# Altium schematic sheet Periferico.SchDoc
size A4
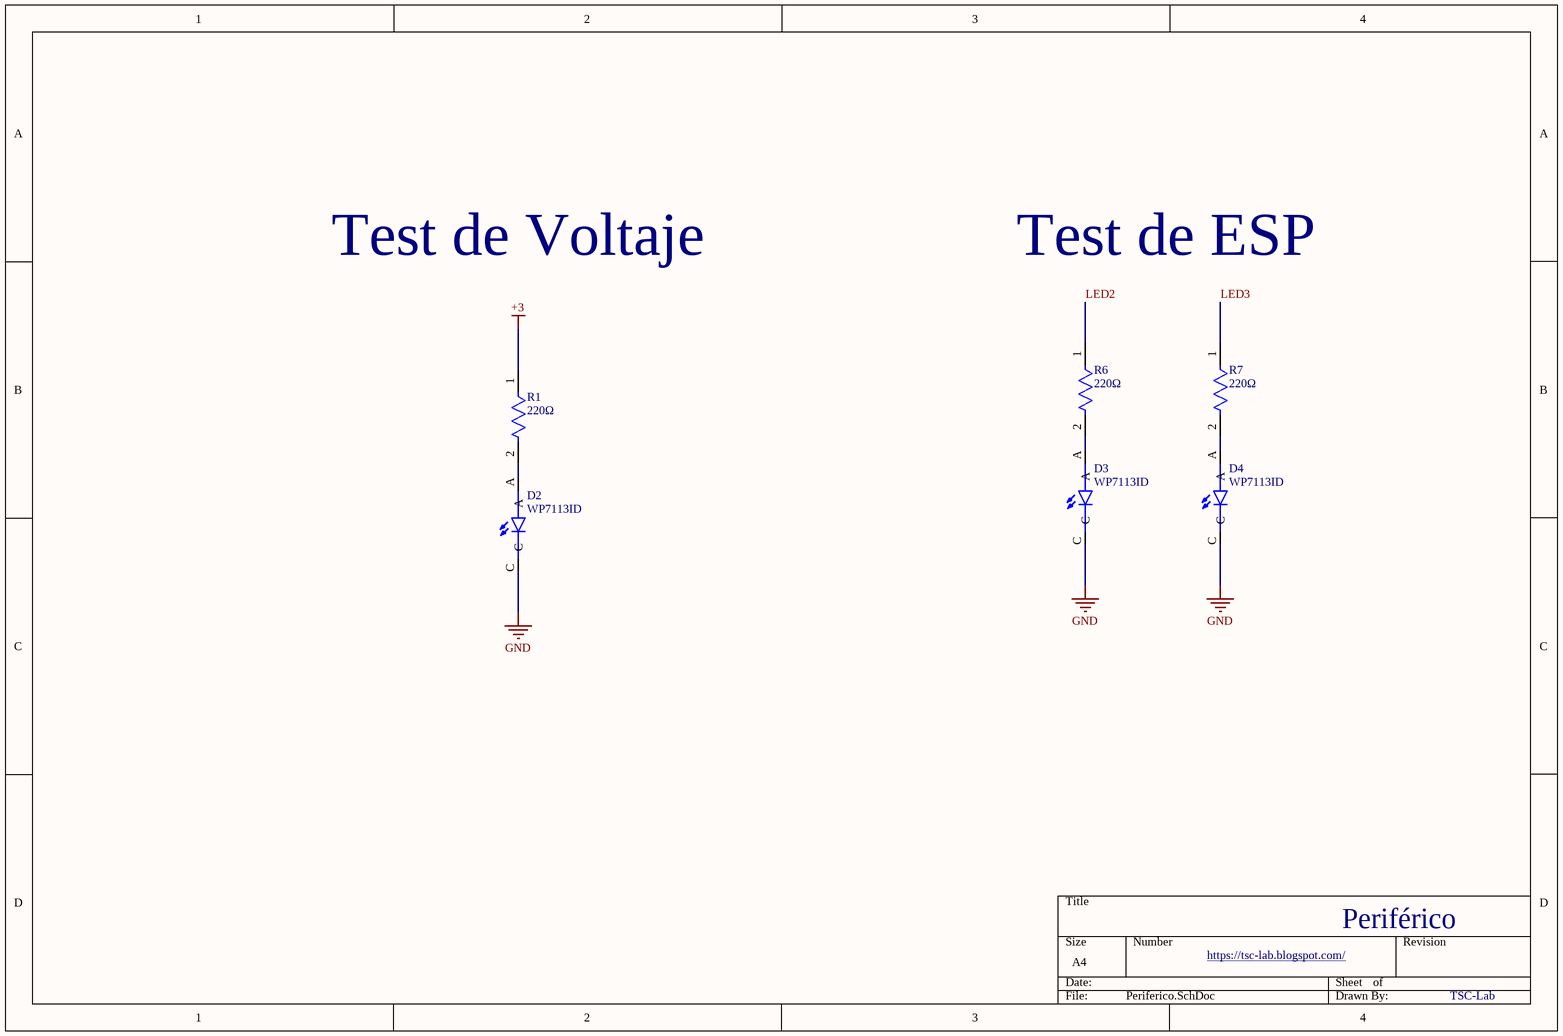
[diagram p0: Periferico.SchDoc]

## Parts
D2  WP7113ID  [LED_WP7113ID]
D3  WP7113ID  [LED_WP7113ID]
D4  WP7113ID  [LED_WP7113ID]
R1  Resistance: 220Ω  [Vishay_SFR2500002200FR500_0]  (hidden comment: Res_Vishay_SFR2500002200FR500_eec)
R6  Resistance: 220Ω  [Vishay_SFR2500002200FR500_0]  (hidden comment: Res_Vishay_SFR2500002200FR500_eec)
R7  Resistance: 220Ω  [Vishay_SFR2500002200FR500_0]  (hidden comment: Res_Vishay_SFR2500002200FR500_eec)

## Nets
+3: R1.1
GND: D2.C D3.C D4.C
LED2: R6.1
LED3: R7.1
NetD2_A: D2.A R1.2
NetD3_A: D3.A R6.2
NetD4_A: D4.A R7.2

## Notes on the sheet
- Test de Voltaje
- Test de ESP
- https://tsc-lab.blogspot.com/
- Periférico
- TSC-Lab

## Library data of the parts
D2-D4 = WP7113ID: LED; Thru-Hole; Green; T1-3/4; 5mm; Clear Lens; 25ma; 565nm; 200mcd; Round; MF: {'manufacturer': u'Kingbright'}; Package: None; Price: None; Availability: Unavailable; MP: WP7113ID; Value: *
R1 R6 R7 = Res_Vishay_SFR2500002200FR500_eec: RES 220 OHM 0.4W 1% AXIAL; Manufacturer: Vishay; Voltage: 250 V; Value: 220Ω; power_rating: 400 mW; Category 7542B8484461Ae85: Passive Components; Category 5A00970A6D5C81C7: Uncategorized; Category 5C6A91606D4187Ad: Resistors; Power: 400mW; Category Cd01000Bfc2916C6: Single Components; Symbol 0 0: Resistor; Num Pins: 2; Part Number: SFR2500002200FR500; helpURL: https://upverter.com/upn/revision/077f2be647fd95a8/; ComponentLink2Description: Datasheet; Temperature: -55°C to +155°C; Package: AXIAL; Supplier 2: Mouser; Price: 0.0503066408853; Supplier 1: Digi-Key; ComponentLink1URL: https://upverter.com/upn/revision/077f2be647fd95a8/; Supplier Part Number 2: 594-5043ED220R0F; Supplier Part Number 1: PPC220YCT-ND; ComponentLink1Description: Upverter; ComponentLink2URL: http://www.vishay.com/docs/28722/sfr16s25.pdf; RoHS: TRUE; Mouser Part Number: 594-5043ED220R0F; Operating temperature range: -55 °C to 155 °C; voltage_rating_dc: 250 V; Ipc Land Pattern Name: RESAD1076W80L750D250; Tolerance: 1%; Temperature Range High: +155°C; Octopart Part Number: d6c31f7a8f400904; Digikey Description: RES 220 OHM 0.4W 1% AXIAL; Digikey Part Number: PPC220YCT-ND; Type: resistor; Lead Free: yes; Temperature Range Low: -55°C